# Altium schematic sheet SH3 - 17V BUCK CONVERTER.SchDoc: 17V Buck Converter
size B; CheckedBy: Lance Bantoto; Engineer: Cindy Li; Organization: UW Robotics; Address1: 200 University Avenue; Address2: Waterloo; Address3: Ontario; Address4: Canada N2L 3G6; DocumentNumber: 3; Revision: 2; SheetNumber: 3; SheetTotal: 10
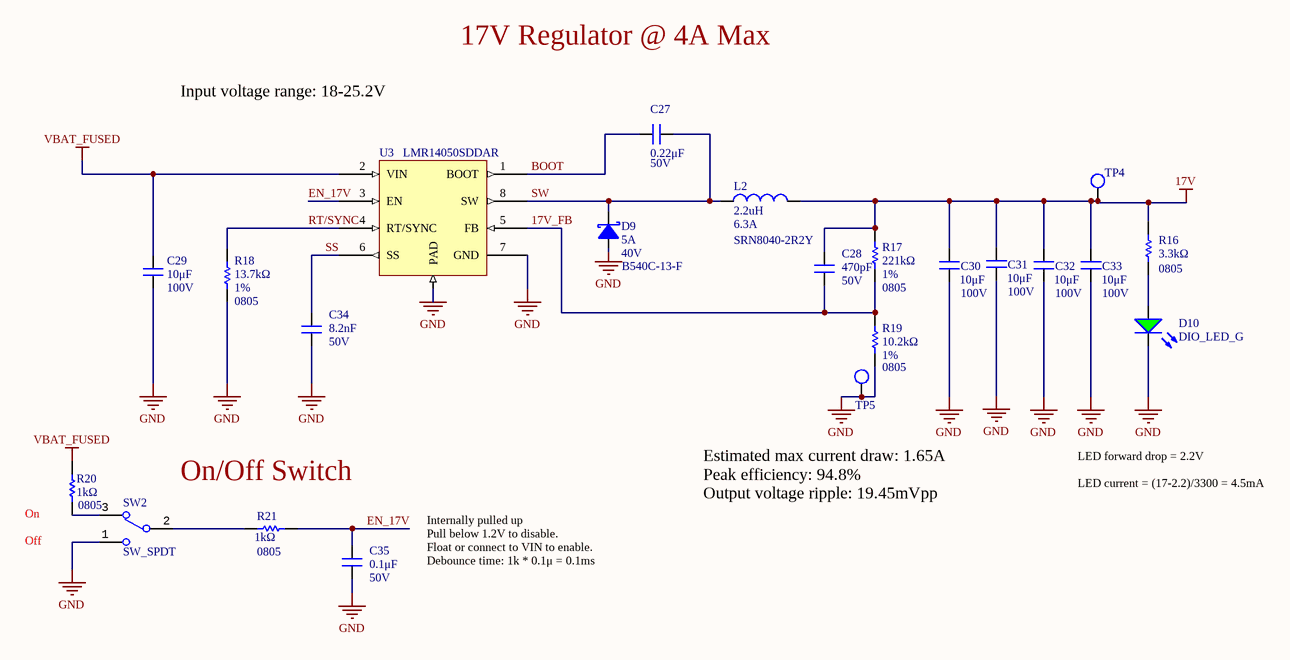
[diagram p0: SH3 - 17V BUCK CONVERTER.SchDoc]

## Parts
C27  value 0.22μF  Voltage Rating: 50V  [CAP2012]  (hidden comment: CAP_0.22uF_50V_0805)
C28  Voltage Rating: 50V  Capacitance: 470pF  [CAP2012]  (hidden comment: CAP_470pF_50V_0805)
C29  value 10μF  Voltage Rating: 100V  [CAP1210]  (hidden comment: CAP_10uF_100V_1210)
C30  value 10μF  Voltage Rating: 100V  [CAP1210]  (hidden comment: CAP_10uF_100V_1210)
C31  value 10μF  Voltage Rating: 100V  [CAP1210]  (hidden comment: CAP_10uF_100V_1210)
C32  value 10μF  Voltage Rating: 100V  [CAP1210]  (hidden comment: CAP_10uF_100V_1210)
C33  value 10μF  Voltage Rating: 100V  [CAP1210]  (hidden comment: CAP_10uF_100V_1210)
C34  Voltage Rating: 50V  Capacitance: 8.2nF  [CAP2012]  (hidden comment: CAP_8200pF_50V_0805)
C35  value 0.1μF  Voltage Rating: 50V  [CAP2012]  (hidden comment: CAP_0.1uF_50V_0805)
D9  Forward Current: 5A  Voltage: 40V  [DO214AB SMC]  (hidden comment: B540C-13-F)
D10  DIO_LED_G  [LED_0805_GREEN]
L2  Inductance: 2.2uH  Max DC Current: 6.3A  [IND_BOURNS_SRN80]  (hidden comment: SRN8040-2R2Y)
R16  Resistance: 3.3kΩ  Package/Footprint: 0805  [RESC0805]  (hidden comment: RES_3.3kΩ_0805_1%)
R17  Tolerance: 1%  Resistance: 221kΩ  Package/Footprint: 0805  [RESC0805]  (hidden comment: RES_221kΩ_0805_1%)
R18  Tolerance: 1%  Resistance: 13.7kΩ  Package/Footprint: 0805  [RESC0805]  (hidden comment: RES_13.7kΩ_0805_1%)
R19  Tolerance: 1%  Resistance: 10.2kΩ  Package/Footprint: 0805  [RESC2012X60N]  (hidden comment: RES_10.2kΩ_0805_1%)
R20  Resistance: 1kΩ  Package/Footprint: 0805  [RESC0805]  (hidden comment: RES_1kΩ_0805_1%)
R21  Resistance: 1kΩ  Package/Footprint: 0805  [RESC0805]  (hidden comment: RES_1kΩ_0805_1%)
SW2  SW_SPDT  [100SP1T1B4M2QE]
TP4  TESTPOINT_LOOP  [TESTPOINT_LOOP]  (value not drawn)
TP5  TESTPOINT_LOOP  [TESTPOINT_LOOP]  (value not drawn)
U3  LMR14050SDDAR  [8-PowerSOIC]

## Nets
17V: C28.2 C30.2 C31.2 C32.2 C33.2 L2.2 R16.2 R17.2 TP4.1
GND: C29.2 C30.1 C31.1 C32.1 C33.1 C34.1 C35.1 D9.1(Anode) D10.2(K) R18.1 R19.1 SW2.1 TP5.1 U3.7(GND) U3.9(PAD)
VBAT_FUSED: C29.1 R20.2 U3.2(VIN)
17V_FB: C28.1 R17.1 R19.2 U3.5(FB)
BOOT: C27.2 U3.1(BOOT)
EN_17V: C35.2 R21.2 U3.3(EN)
RT/SYNC: R18.2 U3.4(RT/SYNC)
SS: C34.2 U3.6(SS)
SW: C27.1 D9.2(Cathode) L2.1 U3.8(SW)
NetD10_1: D10.1(A) R16.1
NetR20_1: R20.1 SW2.3
NetR21_1: R21.1 SW2.2

## Notes on the sheet
- 17V Regulator @ 4A Max
- Input voltage range: 18-25.2V
- (near R20) On
- On/Off Switch
- Estimated max current draw: 1.65A
  Peak efficiency: 94.8%
  Output voltage ripple: 19.45mVpp
- LED forward drop = 2.2V
  LED current = (17-2.2)/3300 = 4.5mA
- (near R20) Off
- Internally pulled up
  Pull below 1.2V to disable.
  Float or connect to VIN to enable.
  Debounce time: 1k * 0.1μ = 0.1ms
- Title:
- Project:
- Date:
- Rev:
- Reviewer:
- Engineer:
- Sheet:
- of

## Library data of the parts
C27 = CAP_0.22uF_50V_0805: CAP CER 0.22UF 50V X7R 0805; Manufacturer 1: KEMET; Manufacturer Part Number 1: C0805C224K5RACTU; Package/Footprint: 0805; Dielectric: X7R; Supplier 1: Digi-Key; Supplier Part Number 1: 399-3491-1-ND; LCSC Part #: C5378; Mounting Type: SMD
C28 = CAP_470pF_50V_0805: CAP CER 470PF 50V X7R 0805; Manufacturer 1: Kyocera AVX; Manufacturer Part Number 1: 08055C471JAT2A; Package/Footprint: 0805; Supplier 1: Digi-Key; Dielectric: X7R; Supplier Part Number 1: 478-7958-1-ND; Mounting Type: SMD
C29-C33 = CAP_10uF_100V_1210: CAP CER 10uF 100V X7S 10% 1210; Manufacturer 1: Murata; Manufacturer Part Number 1: GRM32EC72A106KE05L; Package/Footprint: 1210; Supplier 1: Digi-Key; Tolerance: 10%; Dielectric: X7S; Supplier Part Number 1: 490-16266-1-ND; Mounting Type: SMD
C34 = CAP_8200pF_50V_0805: CAP CER 8200PF 50V X7R 0805; Package/Footprint: 0805; Dielectric: X7R; Supplier 1: Digi-Key; Supplier Part Number 1: 478-9924-6-ND; Mounting Type: SMD
C35 = CAP_0.1uF_50V_0805: CAP CER 0.1UF 50V X7R 0805; Manufacturer Part Number 1: GCM21BR71H104KA37K; Manufacturer 1: Murata Electronics; Tolerance: 10%; Package/Footprint: 0805; Supplier Part Number 1: 490-8049-1-ND; Supplier 1: Digi-Key; Mount: Surface Mount; Dielectric: X7R; Length: 2mm; Height: 1.25mm; Width: 0.049inch; Thickness: 0.049inch; Depth: 1.25mm; Ratings: AEC-Q200; LCSC Part #: C49678; Mounting Type: SMD
D9 = B540C-13-F: DIODE SCHOTTKY 40V 5A SMC; Manufacturer 1: Diodes; Element Configuration: Single; Peak Reverse Current: 500uA; Peak Non-Repetitive Surge Current: 100A; Forward Voltage: 550mV; Capacitance: 300pF; Supplier 1: Digi-Key; Manufacturer Part Number 1: B540C-13-F; Max Operating Temperature: 125°C; Max Repetitive Reverse Voltage (Vrrm): 40V; Max Forward Surge Current (Ifsm): 100A; Average Rectified Current: 5A; Voltage Rating (DC): 40V; Current Rating: 5A; Max Reverse Voltage (DC): 40V; Current: 5A; Supplier Part Number 1: B540C-FDIDKR-ND; LCSC Part #: C72264; Mounting Type: SMD; Package/Footprint: SMC
D10 = DIO_LED_G: LED GREEN DIFFUSED 0805 SMD; Manufacturer Part Number 1: LG R971-KN-1; Manufacturer 1: OSRAM; Forward Voltage Drop: 2.2V; Package/Footprint: 0805; Supplier Part Number 1: 475-1410-1-ND; Supplier 1: Digi-Key; Mounting Type: SMD
L2 = SRN8040-2R2Y: FIXED IND 2.2UH 6.3A 13 MOHM SMD; Manufacturer 1: Bourns; Core Material: Ferrite; Material: Steel; DC Resistance (DCR): 13mR; Tolerance: 30%; Self Resonant Frequency: 40MHz; Test Frequency: 100kHz; Shielding: Shielded; Saturation Current: 7.4A; Supplier 1: Digi-Key; Manufacturer Part Number 1: SRN8040-2R2Y; Number of Pins: 2; Weight: 0.028607oz; Contact Plating: Tin; Min Operating Temperature: -40°C; Max Operating Temperature: 125°C; Termination: SMD/SMT; Composition: Wirewound; DC Current: 6.3A; Military Standard: Not; RMS Current (Irms): 6.3A; Inductance Tolerance: 30%; Current Rating: 6.3A; Length: 8mm; Height: 4mm; Height - Seated (Max): 0.157inch; Depth: 8.3mm; Width: 8mm; REACH SVHC: No SVHC; ComponentLink7URL: https://datasheet.ciiva.com/1049/srn8040-1049455.pdf?src-supplier=Digi-Key; ComponentLink7Description: https://datasheet.ciiva.com/1049/srn8040-1049455.pdf?src-supplier=Digi-Key; ComponentLink8URL: https://datasheet.ciiva.com/17284/srn8040-17284783.pdf?src-supplier=Avnet+Europe; ComponentLink8Description: https://datasheet.ciiva.com/17284/srn8040-17284783.pdf?src-supplier=Avnet+Europe; ComponentLink9URL: https://datasheet.ciiva.com/48691/001056460-da-01-en-mag-abg-leist-ind-srn8040-2r2y-2-2uh-smd-48691836.pdf?src-supplier=Conrad; ComponentLink9Description: https://datasheet.ciiva.com/48691/001056460-da-01-en-mag-abg-leist-ind-srn8040-2r2y-2-2uh-smd-48691836.pdf?src-supplier=Conrad; Supplier Part Number 1: SRN8040-2R2YCT-ND; Mounting Type: SMD; Package/Footprint: SMD
R16 = RES_3.3kΩ_0805_1%: RES 3.3K OHM 1% 1/8W 0805; Manufacturer 1: Vishay Dale; Manufacturer Part Number 1: CRCW06033K30FKEA; Supplier 1: Digi-Key; Tolerance: 1%; Supplier Part Number 1: 541-3.30KHCT-ND; LCSC Part #: C26010; Mounting Type: SMD
R17 = RES_221kΩ_0805_1%: RES 221K OHM 1% 1/8W 0805; Manufacturer 1: Vishay; Manufacturer Part Number 1: CRCW0805221KFKEA; Supplier 1: Digi-Key; Supplier Part Number 1: 541-221KCCT-ND; LCSC Part #: C75431; Mounting Type: SMD
R18 = RES_13.7kΩ_0805_1%: RES 13.7K OHM 1% 1/8W 0805; Manufacturer 1: Vishay; Manufacturer Part Number 1: CRCW080513K7FKEA; Supplier 1: Digi-Key; Supplier Part Number 1: 541-13.7KCCT-ND; LCSC Part #: C17448; Mounting Type: SMD
R19 = RES_10.2kΩ_0805_1%: RES 10.2K OHM 1% 1/8W 0805; Manufacturer 1: Vishay; Manufacturer Part Number 1: CRCW080510K2FKEA; Supplier 1: Digi-Key; Supplier Part Number 1: 541-10.2KCCT-ND; LCSC Part #: C17402; Mounting Type: SMD
R20 R21 = RES_1kΩ_0805_1%: RES 1K OHM 1% 1/8W 0805; Manufacturer 1: Yageo; Manufacturer Part Number 1: RC0805FR-071KL; Supplier 1: Digi-Key; Tolerance: 1%; Supplier Part Number 1: 311-1.00KCRCT-ND; LCSC Part #: C17513; Mounting Type: SMD
SW2 = SW_SPDT: SWITCH TOGGLE SPDT 5A 120V; Manufacturer 1: E-Switch; Voltage Rating (DC): 28V; Package/Footprint: TH; Supplier 1: Digi-Key; Manufacturer Part Number 1: 100SP1T1B4M2QE; Throw Configuration: SPDT; Supplier Part Number 1: EG2355-ND; Current Rating: 5A; Mounting Type: TH
TP4 TP5 = TESTPOINT_LOOP: PC TEST POINT MINIATURE WHITE; Manufacturer 1: Keystone Electronics; Manufacturer Part Number 1: 5002; Package/Footprint: TH; Supplier 1: Digi-Key; Supplier Part Number 1: 36-5002-ND; Mounting Type: TH
U3 = LMR14050SDDAR: IC REG BUCK ADJUSTABLE 5A 8SOPWR; Manufacturer 1: Texas Instruments; Output Configuration: Positive; Quiescent Current: 40uA; Supplier 1: Digi-Key; Manufacturer Part Number 1: LMR14050SDDAR; Output Type: Adjustable; Supplier Part Number 1: 296-44322-1-ND; LCSC Part #: C155484; Mounting Type: SMD; Package/Footprint: 8-PowerSOIC